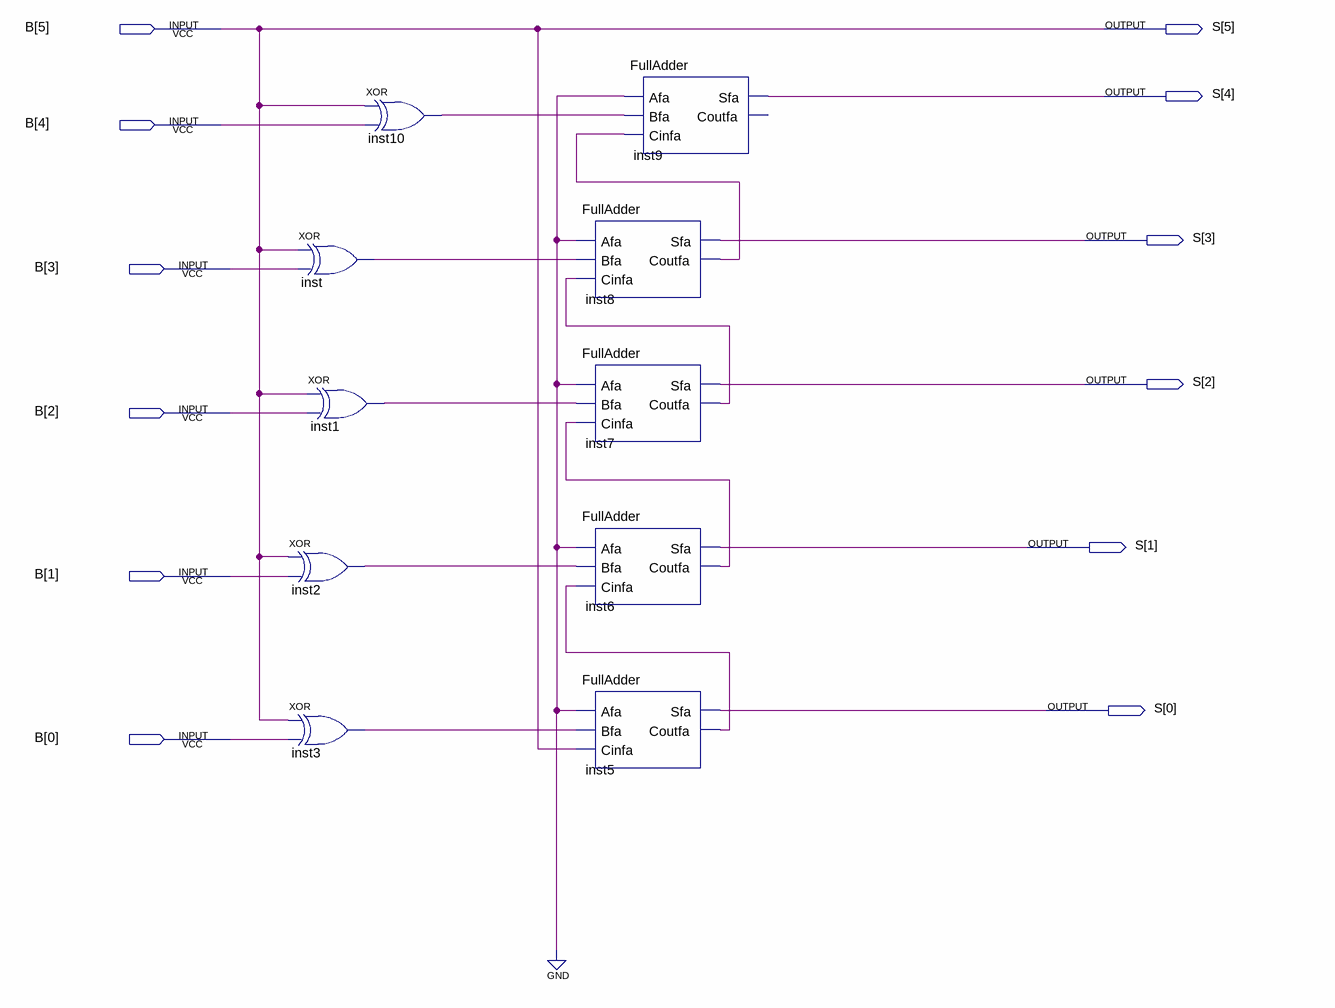
[diagram p0: schematic sheet]
// Quartus schematic twosComplementespecial.bdf as structural Verilog: 10 symbols, 12 pins
module twosComplementespecial (
  input  [5:0] B,
  output [5:0] S
);

  wire inst1_out, inst2_out, inst3_out, inst5_coutfa, inst6_coutfa, inst7_coutfa, inst8_coutfa, inst10_out,
       inst_out;

  xor inst (inst_out, B[5], B[3]);
  xor inst1 (inst1_out, B[5], B[2]);
  xor inst2 (inst2_out, B[5], B[1]);
  xor inst3 (inst3_out, B[5], B[0]);
  xor inst10 (inst10_out, B[5], B[4]);
  FullAdder inst8 (.Afa(1'b0), .Bfa(inst_out), .Cinfa(inst7_coutfa), .Sfa(S[3]), .Coutfa(inst8_coutfa));
  FullAdder inst7 (.Afa(1'b0), .Bfa(inst1_out), .Cinfa(inst6_coutfa), .Sfa(S[2]), .Coutfa(inst7_coutfa));
  FullAdder inst6 (.Afa(1'b0), .Bfa(inst2_out), .Cinfa(inst5_coutfa), .Sfa(S[1]), .Coutfa(inst6_coutfa));
  FullAdder inst5 (.Afa(1'b0), .Bfa(inst3_out), .Cinfa(B[5]), .Sfa(S[0]), .Coutfa(inst5_coutfa));
  FullAdder inst9 (.Afa(1'b0), .Bfa(inst10_out), .Cinfa(inst8_coutfa), .Sfa(S[4]));  // open: Coutfa

  assign S[5] = B[5];
endmodule
